# EAGLE schematic CutDown2_BreadBoard (EAGLE 7.1.0)
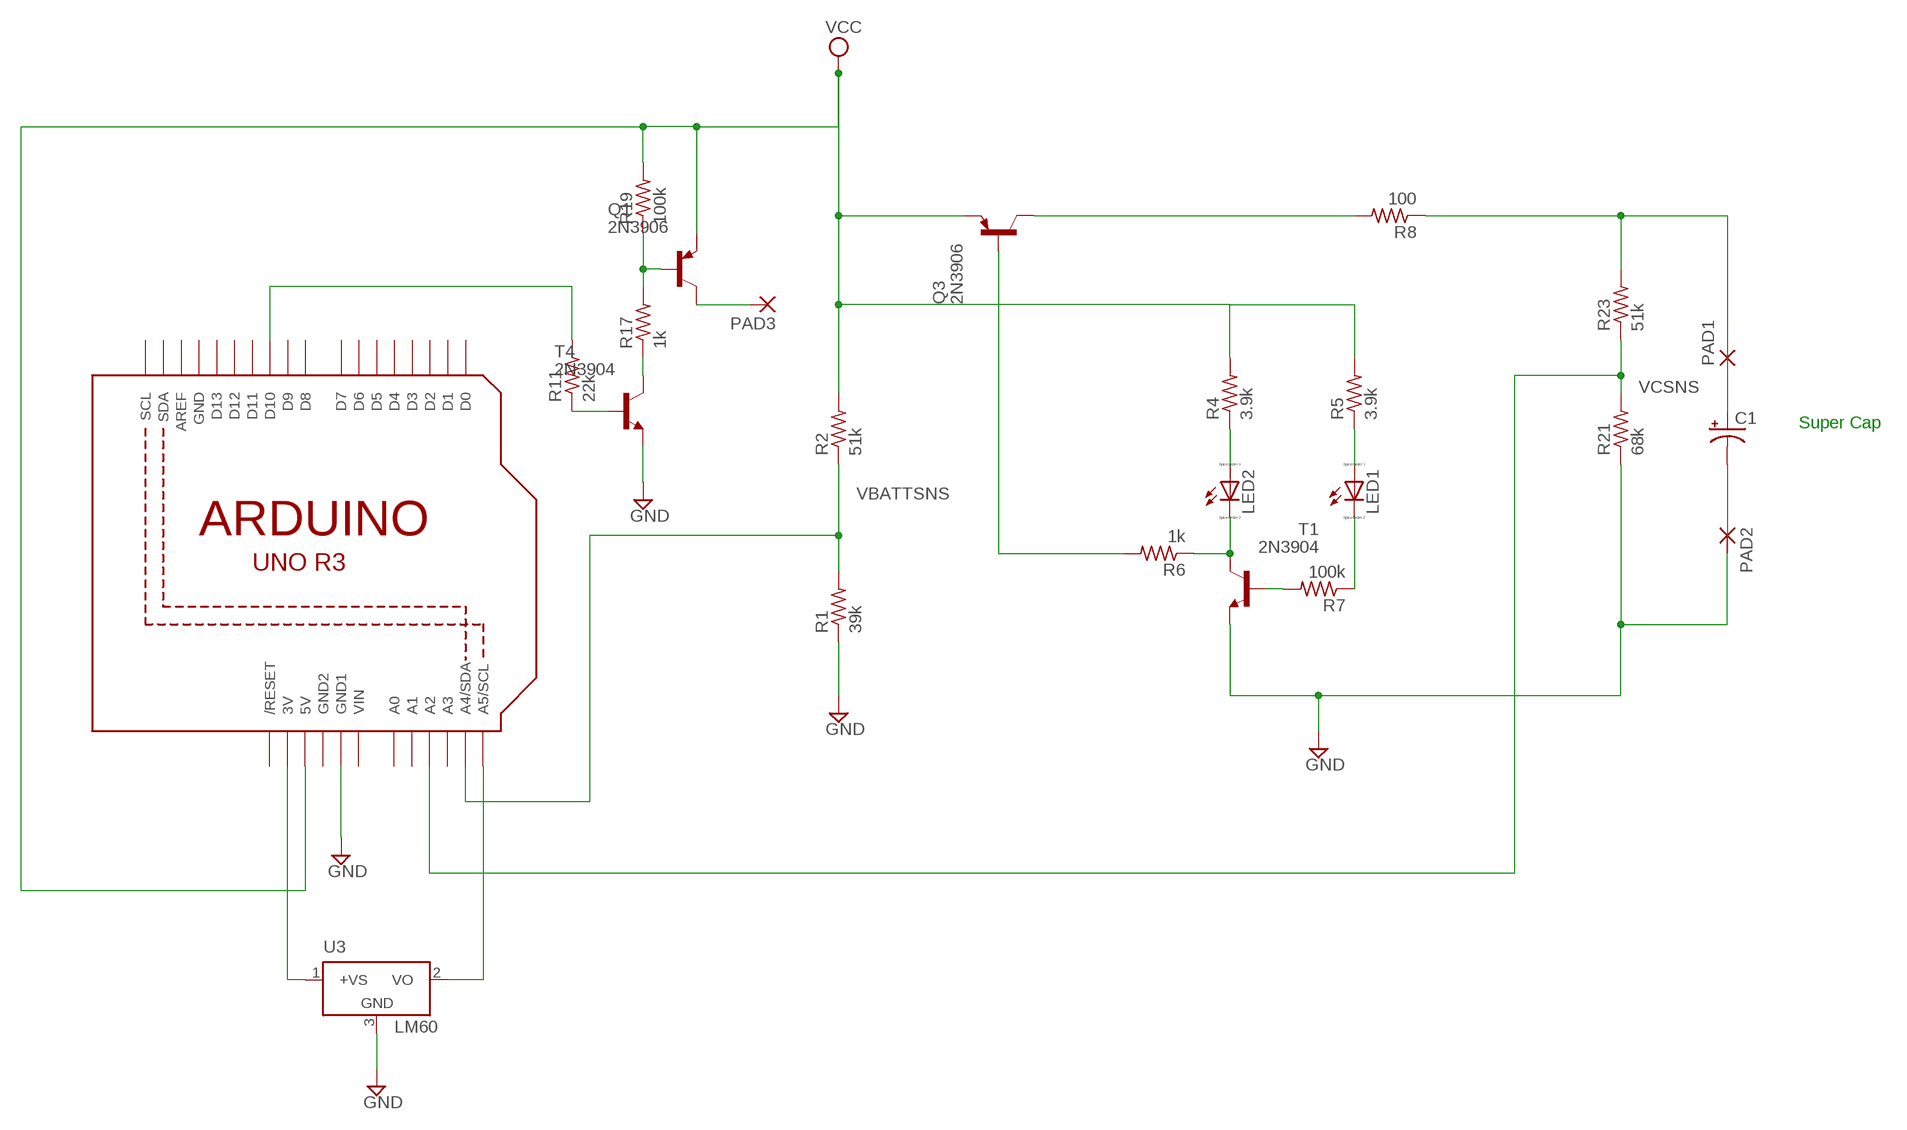
[diagram p0: schematic, sheet 1]

## Parts
C1  CPOL-USE10-30  [EB30D]
LED1  LED_ELD260  [LED_LD260]
LED2  LED_ELD260  [LED_LD260]
PAD1  2,15/1,0  [2,15/1,0]
PAD2  2,15/1,0  [2,15/1,0]
PAD3  2,15/1,0  [2,15/1,0]
Q1  2N3906  [TO92]
Q2  ARDUINOR3-NOIOREF-NOTEXT  [ARDUINOR3-NOTEXT-NOIOREF]
Q3  2N3906  [TO92]
R1  39k  R-US_0207/7  [0207/7]
R2  51k  R-US_0207/7  [0207/7]
R4  3.9k  R-US_0207/7  [0207/7]
R5  3.9k  R-US_0207/7  [0207/7]
R6  1k  R-US_0207/7  [0207/7]
R7  100k  R-US_0207/7  [0207/7]
R8  100  R-US_0207/7  [0207/7]
R11  22k  R-US_0207/7  [0207/7]
R17  1k  R-US_0207/7  [0207/7]
R19  100k  R-US_0207/7  [0207/7]
R21  68k  R-US_0207/7  [0207/7]
R23  51k  R-US_0207/7  [0207/7]
T1  2N3904  [TO92]
T4  2N3904  [TO92]
U3  LM60  [TO92]

## Nets
GND: C1.- PAD2.1(P) Q2.GND1 R1.1 R21.1 T1.3(E) T4.3(E) U3.3(GND)
N$2: Q3.1(C) R8.2
N$3: LED1.K(C) R7.1
N$4: LED1.A R5.1
N$5: LED2.A R4.1
N$6: LED2.K(C) R6.1 T1.1(C)
N$7: Q3.2(B) R6.2
N$13: R7.2 T1.2(B)
N$21: R17.1 T4.1(C)
N$22: Q1.2(B) R17.2 R19.1
N$24: PAD3.1(P) Q1.1(C)
N$25: Q2.A5(A5/SCL) U3.2(VO)
N$26: Q2.D10 R11.2
N$30: Q2.3V U3.1(+VS)
N$31: R11.1 T4.2(B)
N$41: C1.+ PAD1.1(P) R8.1 R23.2
VBATTSNS: Q2.A4(A4/SDA) R1.2 R2.1
VCC: Q1.3(E) Q2.5V Q3.3(E) R2.2 R4.2 R5.2 R19.2
VCSNS: Q2.A2 R21.2 R23.1
Unconnected: Q2.A0 Q2.A1 Q2.A3 Q2.AREF Q2.D0 Q2.D1 Q2.D2 Q2.D3 Q2.D4 Q2.D5 Q2.D6 Q2.D7 Q2.D8 Q2.D9 Q2.D11 Q2.D12 Q2.D13 Q2.RESET(/RESET) Q2.SCL Q2.SDA

## Notes on the sheet
- Super Cap

## Power pins joined to a net without a drawn wire
GND: Q2.GND
GND2: Q2.GND2
VIN: Q2.VIN

## Library data of the parts
C1 = adafruit:CPOL-US: POLARIZED CAPACITOR, American symbol
LED1 LED2 = eagle-ltspice:LED_E: LED Source: http://www.osram.convergy.de Source: www.luxeon.com Source: www.kingbright.com; SPICEMODEL: NONE; SPICEPREFIX: D; SPICETYPE: diode
PAD1-PAD3 = wirepad:2,15/1,0: THROUGH-HOLE PAD
Q1 Q3 = transistor-pnp:2N3906: PNP Transistor
Q2 = adafruit-fh:ARDUINOR3-NOIOREF
R1 R2 R4-R8 R11 R17 R19 R21 R23 = rcl:R-US_: RESISTOR, American symbol
T1 T4 = transistor:2N3904: NPN TRANSISTOR
U3 = mydevices:LM60